# Altium schematic sheet PWB.SchDoc: =DocumentName
size A3; Scale: 1:1; DocumentType: Схема электрическая принципиальная; FirstReferrence: АБВГ.123456.001; CompanyName: "AS Manufacturing" LLC; Organization: "AS Manufacturing" LLC; Address1: 5 Sklyarenka St.; Address2: Kyiv 04073; Address3: Ukraine; Address4: https://ajax.systems/en/; SheetNumber: 1; SheetTotal: 10; Template_version: 1.0.1
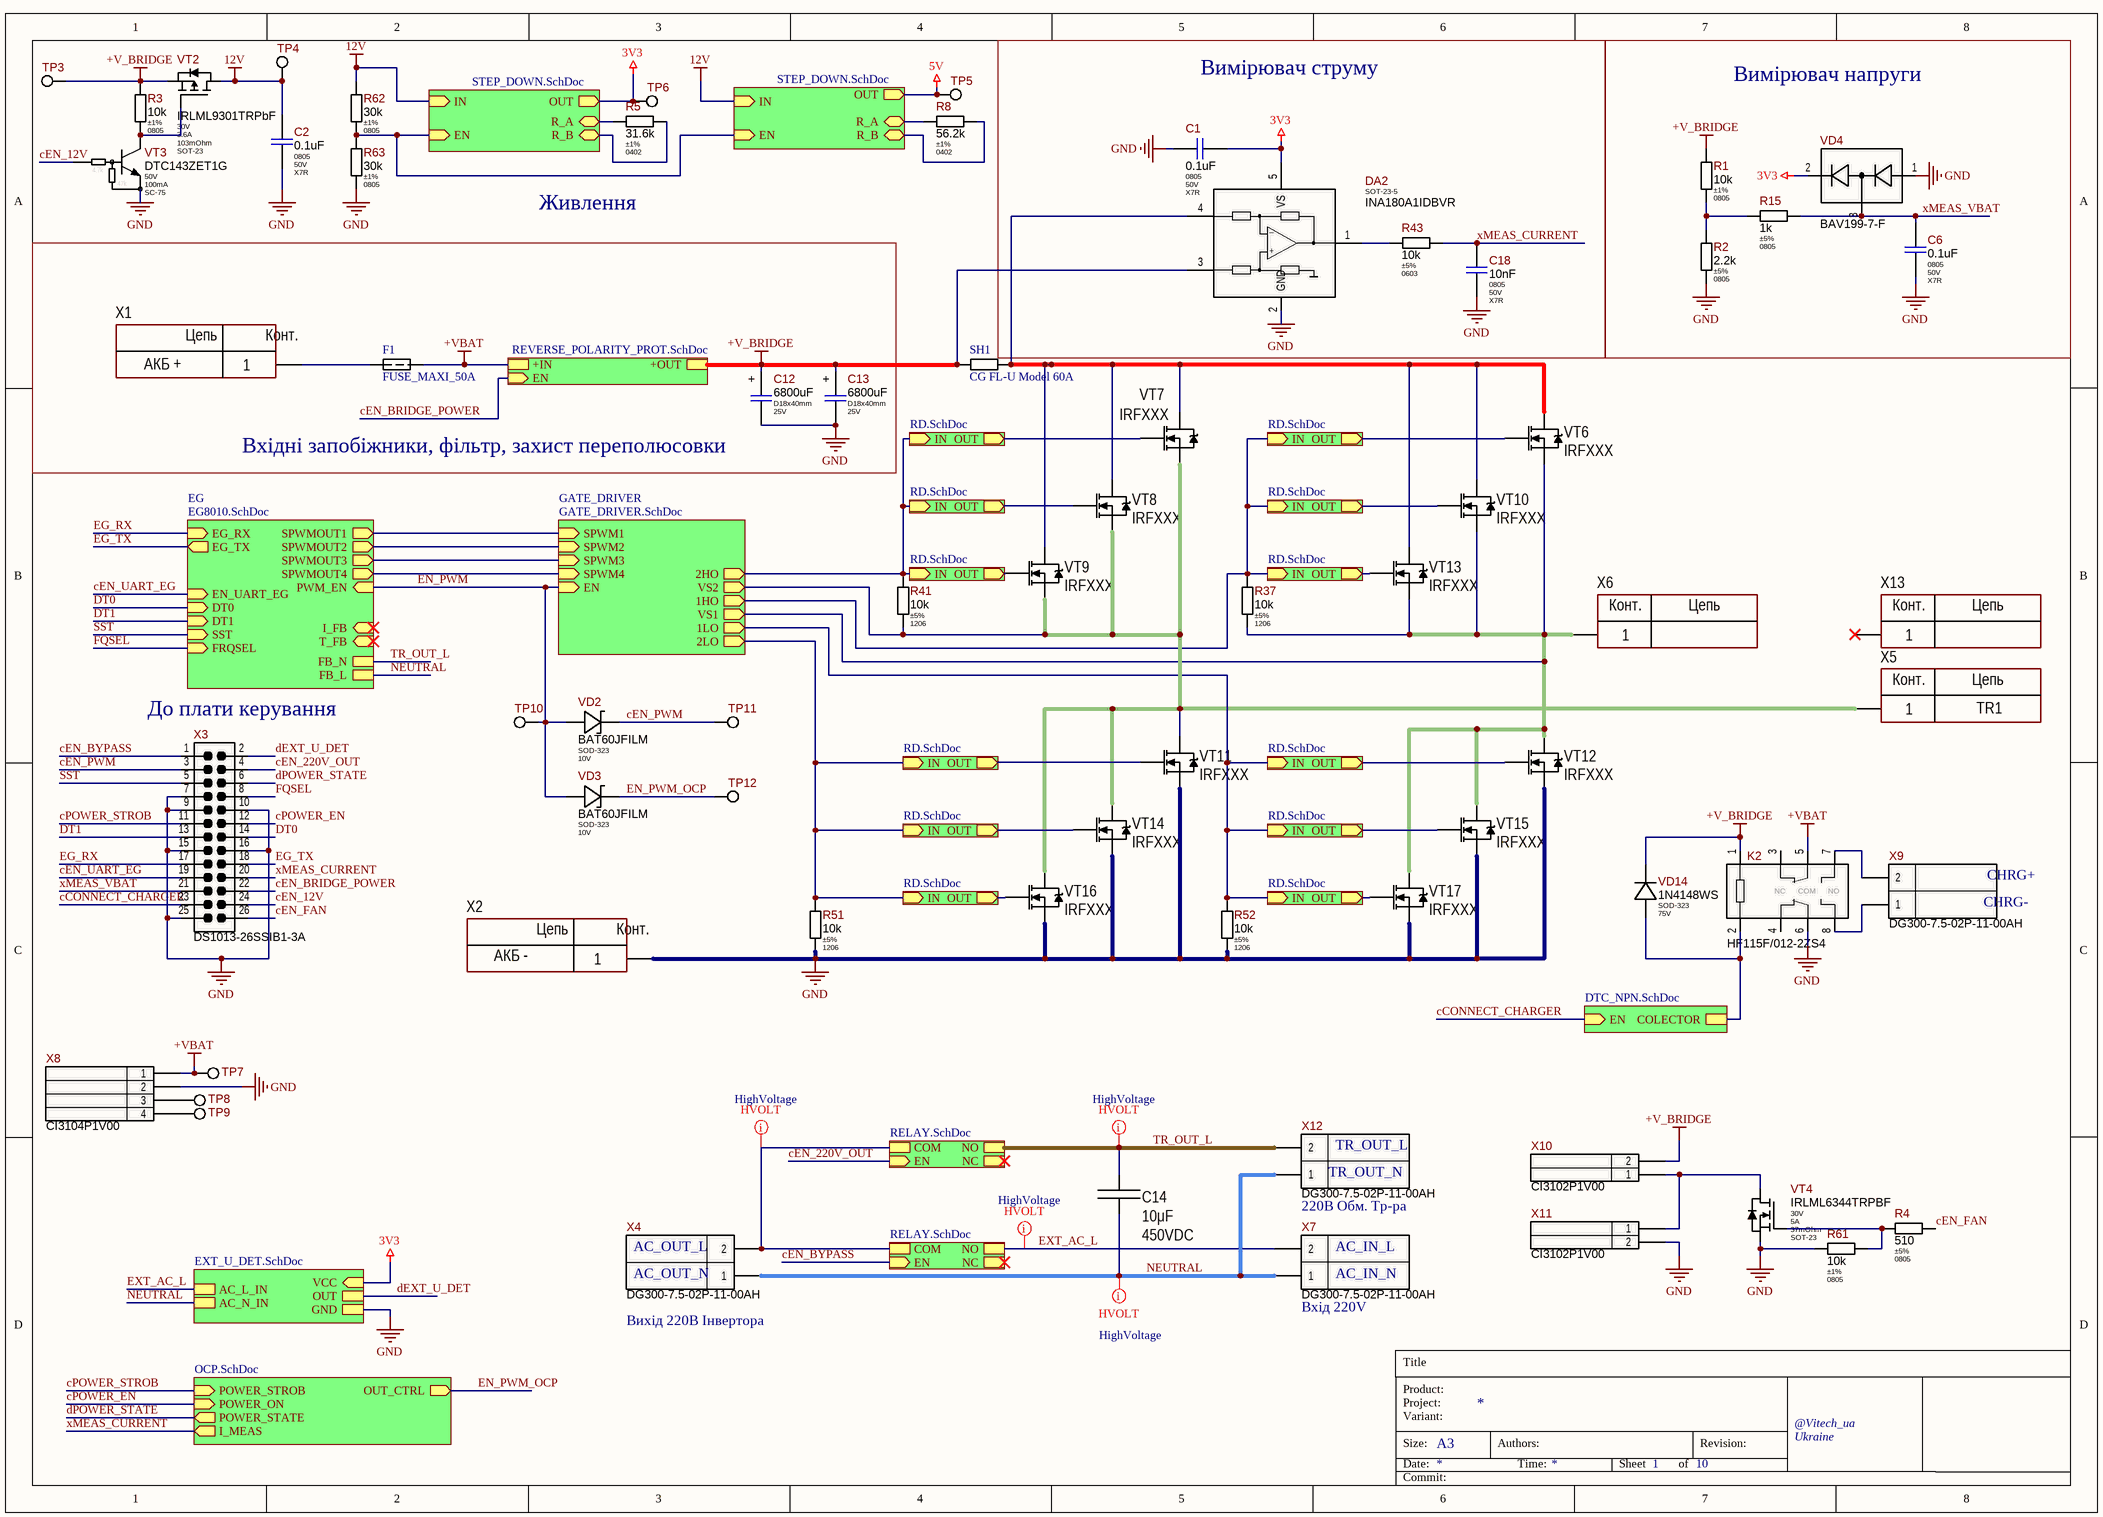
[diagram p0: PWB.SchDoc]

## Parts
C1  Package: 0805  Voltage: 50V  Dielectric Type: X7R  [CAP-0805(2012)X85T10]  (hidden comment: 0.1uF)
C2  Package: 0805  Voltage: 50V  Dielectric Type: X7R  [CAP-0805(2012)X85T10]  (hidden comment: 0.1uF)
C6  Package: 0805  Voltage: 50V  Dielectric Type: X7R  [CAP-0805(2012)X85T10]  (hidden comment: 0.1uF)
C12  value 6800uF  Package: D18x40mm  Voltage: 25V  [CAP-AE-PTH-180D05x400H20]  (hidden comment: 6800uFx25V)
C13  value 6800uF  Package: D18x40mm  Voltage: 25V  [CAP-AE-PTH-180D05x400H20]  (hidden comment: 6800uFx25V)
C14  value 10μF  Voltage: 450VDC  [CAP: B32922 (18x7x12.5mm)]
C18  Package: 0805  Voltage: 50V  Dielectric Type: X7R  [CAP-0805(2012)X65T10]  (hidden comment: 10nF)
DA2  INA180A1IDBVR  [SOT-23-5]
F1  FUSE_MAXI_50A  [FUSE_MAXI_50A]
K2  HF115F/012-2ZS4  [HF115Fxxx-1(2)Zx3(4)]
R1  Tolerance: ±1%  Package: 0805  [R_ANY_CHIP_0805_MED]  (hidden comment: 10k)
R2  Tolerance: ±5%  Package: 0805  [R_ANY_CHIP_0805_MED]  (hidden comment: 2.2k)
R3  Tolerance: ±1%  Package: 0805  [R_ANY_CHIP_0805_MED]  (hidden comment: 10k)
R4  Tolerance: ±5%  Package: 0805  [R_ANY_CHIP_0805_MED]  (hidden comment: 510)
R5  Tolerance: ±1%  Package: 0402  [R_ANY_CHIP_0402_MED]  (hidden comment: 31.6k)
R8  Tolerance: ±1%  Package: 0402  [R_ANY_CHIP_0402_MED]  (hidden comment: 56.2k)
R15  Tolerance: ±5%  Package: 0805  [R_ANY_CHIP_0805_MED]  (hidden comment: 1k)
R37  Tolerance: ±5%  Package: 1206  [R_ANY_CHIP_1206_MED]  (hidden comment: 10k)
R41  Tolerance: ±5%  Package: 1206  [R_ANY_CHIP_1206_MED]  (hidden comment: 10k)
R43  Tolerance: ±5%  Package: 0603  [R_ANY_CHIP_0603_MED]  (hidden comment: 10k)
R51  Tolerance: ±5%  Package: 1206  [R_ANY_CHIP_1206_MED]  (hidden comment: 10k)
R52  Tolerance: ±5%  Package: 1206  [R_ANY_CHIP_1206_MED]  (hidden comment: 10k)
R61  Tolerance: ±1%  Package: 0805  [R_ANY_CHIP_0805_MED]  (hidden comment: 10k)
R62  Tolerance: ±1%  Package: 0805  [R_ANY_CHIP_0805_MED]  (hidden comment: 30k)
R63  Tolerance: ±1%  Package: 0805  [R_ANY_CHIP_0805_MED]  (hidden comment: 30k)
SH1  CG FL-U Model 60A  [CG FL-U Model 60A]
TP3  PAD-0.96mm  [PAD-0.96mm]  (value not drawn)  (no BOM)
TP4  PAD-0.96mm  [PAD-0.96mm]  (value not drawn)  (no BOM)
TP5  PAD-0.96mm  [PAD-0.96mm]  (value not drawn)  (no BOM)
TP6  PAD-0.96mm  [PAD-0.96mm]  (value not drawn)  (no BOM)
TP7  PAD-0.96mm  [PAD-0.96mm]  (value not drawn)  (no BOM)
TP8  PAD-0.96mm  [PAD-0.96mm]  (value not drawn)  (no BOM)
TP9  PAD-0.96mm  [PAD-0.96mm]  (value not drawn)  (no BOM)
TP10  PAD-0.96mm  [PAD-0.96mm]  (value not drawn)  (no BOM)
TP11  PAD-0.96mm  [PAD-0.96mm]  (value not drawn)  (no BOM)
TP12  PAD-0.96mm  [PAD-0.96mm]  (value not drawn)  (no BOM)
VD2  Package: SOD-323  Voltage: 10V  [SOD-323_MED]  (hidden comment: BAT60JFILM)
VD3  Package: SOD-323  Voltage: 10V  [SOD-323_MED]  (hidden comment: BAT60JFILM)
VD4  BAV199-7-F  [SOT-23_MED]
VD14  Package: SOD-323  Voltage: 75V  [SOD-323_MED]  (hidden comment: 1N4148WS)
VT2  Vds: 30V  Id: 3.6A  Rds: 103mOhm  Package: SOT-23  [SOT-23_MED]  (hidden comment: IRLML9301TRPbF)
VT3  Vce: 50V  Ic: 100mA  Package: SC-75  [SOT-416]  (hidden comment: DTC143ZET1G)
VT4  Vds: 30V  Id: 5A  Rds: 37mOhm  Package: SOT-23  [SOT-23_MED]  (hidden comment: IRLML6344)
VT6  PartNumber: IRFXXX  [TO220(H)]
VT7  PartNumber: IRFXXX  [TO220(H)]
VT8  PartNumber: IRFXXX  [TO220(H)]
VT9  PartNumber: IRFXXX  [TO220(H)]
VT10  PartNumber: IRFXXX  [TO220(H)]
VT11  PartNumber: IRFXXX  [TO220(H)]
VT12  PartNumber: IRFXXX  [TO220(H)]
VT13  PartNumber: IRFXXX  [TO220(H)]
VT14  PartNumber: IRFXXX  [TO220(H)]
VT15  PartNumber: IRFXXX  [TO220(H)]
VT16  PartNumber: IRFXXX  [TO220(H)]
VT17  PartNumber: IRFXXX  [TO220(H)]
X1  CommentText: АКБ +  [CON: 8191]
X2  CommentText: АКБ -  [CON: 8191]
X3  DS1013-26SSIB1-3A  [BH-26]
X4  DG300-7.5-02P  [DG300-7.5-02P-11-00AH_REC]  (value not drawn)
X5  CommentText: TR1  [CON: 8191]
X6  (no value)  [CON: 8191]
X7  DG300-7.5-02P  [DG300-7.5-02P-11-00AH_REC]  (value not drawn)
X8  WH-04S  [WF-4S]  (value not drawn)
X9  DG300-7.5-02P  [DG300-7.5-02P-11-00AH_REC]  (value not drawn)
X10  WH-02S  [WF-2S]  (value not drawn)
X11  WH-02S  [WF-2S]  (value not drawn)
X12  DG300-7.5-02P  [DG300-7.5-02P-11-00AH_REC]  (value not drawn)
X13  (no value)  [CON: 8191]

## Blocks framed on the sheet
Вимірювач струму: C1 C18 DA2 R43
Вимірювач напруги: C6 R1 R2 R15 VD4
Вхідні запобіжники, фільтр, захист переполюсовки: C12 C13 F1 X1

## Sub-sheets
Designator = RELAY.SchDoc: NO, COM, NC, EN (in)
Designator = RELAY.SchDoc: NO, COM, NC, EN (in)
Designator = RD.SchDoc: IN (in), OUT (out)
Designator = RD.SchDoc: IN (in), OUT (out)
Designator = RD.SchDoc: IN (in), OUT (out)
Designator = RD.SchDoc: IN (in), OUT (out)
Designator = RD.SchDoc: IN (in), OUT (out)
Designator = RD.SchDoc: IN (in), OUT (out)
Designator = RD.SchDoc: IN (in), OUT (out)
Designator = RD.SchDoc: IN (in), OUT (out)
Designator = RD.SchDoc: IN (in), OUT (out)
Designator = RD.SchDoc: IN (in), OUT (out)
Designator = RD.SchDoc: IN (in), OUT (out)
Designator = RD.SchDoc: IN (in), OUT (out)
EG = EG8010.SchDoc: T_FB (in), I_FB (in), PWM_EN (in), SPWMOUT1 (out), SPWMOUT2 (out), SPWMOUT3 (out), SPWMOUT4 (out), EG_RX (in), EG_TX (out), DT0 (in), DT1 (in), SST (in), FRQSEL (in), FB_N, FB_L, EN_UART_EG (in)
GATE_DRIVER = GATE_DRIVER.SchDoc: SPWM3 (in), SPWM4 (in), SPWM1 (in), SPWM2 (in), EN (in), 2HO (out), 2LO (out), 1HO (out), 1LO (out), VS2 (out), VS1 (out)
OC = DTC_NPN.SchDoc: EN (in), COLECTOR
OCP = OCP.SchDoc: POWER_STROB (in), POWER_ON (in), POWER_STATE (out), OUT_CTRL (out), I_MEAS (out)
REVERSE_POL_PROT = REVERSE_POLARITY_PROT.SchDoc: +IN, +OUT, EN (in)
STEP_DOWN = STEP_DOWN.SchDoc: IN (in), OUT (out), R_A (bidir), R_B (bidir), EN (in)
STEP_DOWN = STEP_DOWN.SchDoc: IN (in), OUT (out), R_A (bidir), R_B (bidir), EN (in)
U_DET = EXT_U_DET.SchDoc: AC_L_IN, AC_N_IN, VCC (in), OUT, GND

## Nets
3V3: C1.2 DA2.5(VS) TP6.1 VD4.2 ; sheet STEP_DOWN/OUT, sheet U_DET/VCC
5V: TP5.1 ; sheet STEP_DOWN/OUT
12V: C2.1 R62.1 TP4.1 VT2.3(D) ; sheet STEP_DOWN/IN, sheet STEP_DOWN/IN
+V_BRIDGE: C12.1 C13.1 DA2.3(IN+) K2.1(COIL1) R1.2 R3.1 SH1.1 TP3.1 VD14.CA VT2.2(S) X10.2 ; sheet REVERSE_POL_PROT/+OUT
+VBAT: F1.2 K2.5(1-COM) TP7.1 X8.1 ; sheet REVERSE_POL_PROT/+IN
GND: C1.1 C2.2 C6.2 C12.2 C13.2 C18.2 DA2.2(GND) K2.6(2-COM) R2.2 R51.1 R52.1 R61.1 R63.2 VD4.1 VT3.2(E) VT4.2(S) VT11.3(S) VT12.3(S) VT14.3(S) VT15.3(S) VT16.3(S) VT17.3(S) X2.1 X3.7 X3.9 X3.10 X3.15 X3.16 X3.25 X8.2 X11.2 ; sheet U_DET/GND
cCONNECT_CHARGER: X3.23 ; sheet OC/EN
cEN_12V: VT3.1(B) X3.24
cEN_220V_OUT: X3.4 ; sheet Designator/EN
cEN_BRIDGE_POWER: X3.22 ; sheet REVERSE_POL_PROT/EN
cEN_BYPASS: X3.1 ; sheet Designator/EN
cEN_FAN: R4.2 X3.26
cEN_UART_EG: X3.19 ; sheet EG/EN_UART_EG
cPOWER_EN: X3.12 ; sheet OCP/POWER_ON
cPOWER_STROB: X3.11 ; sheet OCP/POWER_STROB
dEXT_U_DET: X3.2 ; sheet U_DET/OUT
dPOWER_STATE: X3.6 ; sheet OCP/POWER_STATE
DT0: X3.14 ; sheet EG/DT0
DT1: X3.13 ; sheet EG/DT1
EG_RX: X3.17 ; sheet EG/EG_RX
EG_TX: X3.18 ; sheet EG/EG_TX
EN_PWM: TP10.1 VD2.AN VD3.AN ; sheet EG/PWM_EN, sheet GATE_DRIVER/EN
EN_PWM_OCP: TP12.1 VD3.CA ; sheet OCP/OUT_CTRL
EXT_AC_L: X7.2 ; sheet U_DET/AC_L_IN, sheet Designator/NO
FQSEL: X3.8 ; sheet EG/FRQSEL
NEUTRAL: C14.2 X4.1 X7.1 X12.1 ; sheet EG/FB_L, sheet U_DET/AC_N_IN
SST: X3.5 ; sheet EG/SST
TR_OUT_L: C14.1 X12.2 ; sheet EG/FB_N, sheet Designator/NO
xMEAS_CURRENT: C18.1 R43.2 X3.20 ; sheet OCP/I_MEAS
xMEAS_VBAT: C6.1 R15.2 VD4.3 X3.21
сEN_PWM: TP11.1 VD2.CA X3.3
NetDA2_1: DA2.1(OUT) R43.1
NetDA2_4: DA2.4(IN-) SH1.2 VT6.2(D) VT7.2(D) VT8.2(D) VT9.2(D) VT10.2(D) VT13.2(D)
NetF1_1: F1.1 X1.1
NetK2_2: K2.2(COIL2) VD14.AN ; sheet OC/COLECTOR
NetK2_7: K2.7(2-NO) X9.2
NetK2_8: K2.8(2-NO) X9.1
NetR1_1: R1.1 R2.1 R15.1
NetR3_2: R3.2 VT2.1(G) VT3.3(C)
NetR4_1: R4.1 R61.2 VT4.1(G)
NetR5_1: R5.1 ; sheet STEP_DOWN/R_A
NetR5_2: R5.2 ; sheet STEP_DOWN/R_B
NetR8_1: R8.1 ; sheet STEP_DOWN/R_A
NetR8_2: R8.2 ; sheet STEP_DOWN/R_B
NetR37_1: R37.1 VT6.3(S) VT10.3(S) VT12.2(D) VT13.3(S) VT15.2(D) VT17.2(D) X6.1 ; sheet GATE_DRIVER/VS1
NetR37_2: R37.2 ; sheet GATE_DRIVER/1HO, sheet Designator/IN, sheet Designator/IN, sheet Designator/IN
NetR41_1: R41.1 VT7.3(S) VT8.3(S) VT9.3(S) VT11.2(D) VT14.2(D) VT16.2(D) X5.1 ; sheet GATE_DRIVER/VS2
NetR41_2: R41.2 ; sheet GATE_DRIVER/2HO, sheet Designator/IN, sheet Designator/IN, sheet Designator/IN
NetR51_2: R51.2 ; sheet GATE_DRIVER/2LO, sheet Designator/IN, sheet Designator/IN, sheet Designator/IN
NetR52_2: R52.2 ; sheet GATE_DRIVER/1LO, sheet Designator/IN, sheet Designator/IN, sheet Designator/IN
NetR62_2: R62.2 R63.1 ; sheet STEP_DOWN/EN, sheet STEP_DOWN/EN
NetTP8_1: TP8.1 X8.3
NetTP9_1: TP9.1 X8.4
NetVT4_3: VT4.3(D) X10.1 X11.1
NetVT6_1: VT6.1(G) ; sheet Designator/OUT
NetVT7_1: VT7.1(G) ; sheet Designator/OUT
NetVT8_1: VT8.1(G) ; sheet Designator/OUT
NetVT9_1: VT9.1(G) ; sheet Designator/OUT
NetVT10_1: VT10.1(G) ; sheet Designator/OUT
NetVT11_1: VT11.1(G) ; sheet Designator/OUT
NetVT12_1: VT12.1(G) ; sheet Designator/OUT
NetVT13_1: VT13.1(G) ; sheet Designator/OUT
NetVT14_1: VT14.1(G) ; sheet Designator/OUT
NetVT15_1: VT15.1(G) ; sheet Designator/OUT
NetVT16_1: VT16.1(G) ; sheet Designator/OUT
NetVT17_1: VT17.1(G) ; sheet Designator/OUT
NetX4_2: X4.2 ; sheet Designator/COM, sheet Designator/COM
(unnamed): sheet EG/SPWMOUT1, sheet GATE_DRIVER/SPWM1
(unnamed): sheet EG/SPWMOUT2, sheet GATE_DRIVER/SPWM2
(unnamed): sheet EG/SPWMOUT3, sheet GATE_DRIVER/SPWM3
(unnamed): sheet EG/SPWMOUT4, sheet GATE_DRIVER/SPWM4

Not connected (* = marked no-connect by the designer): K2 3(1-NC) 4(2-NC); X13 1*

## Layout directives
net class HighVoltage: EXT_AC_L, NetX4_2, NEUTRAL, TR_OUT_L

## Notes on the sheet
- Живлення
- (near X3) До плати керування
- CHRG-
- CHRG+
- (near X12) TR_OUT_N
- (near X12) TR_OUT_L
- (near X4) AC_OUT_L
- 220В Обм. Тр-ра
- (near X7) AC_IN_L
- (near X4) Вихід 220В Інвертора
- (near X4) AC_OUT_N
- (near X7) Вхід 220V
- (near X7) AC_IN_N
- Title
- Product:
- Project:
- Size:
- Date:
- Variant:
- A3
- Authors:
- Time:
- Sheet
- of
- Revision:
- @Vitech_ua
- Commit:
- (in symbol B41858C5688M000) +
- (in symbol Connector_single_power) Цепь; Конт.
- (in symbol DTC143ZET1G) 4.7k; 47k
- (in symbol HF115F/012-2ZS4) NC; COM; NO
- (in symbol INA180A1IDBVR) _; +

## Library data of the parts
C1 C2 C6 = CL21B104KBCNNNC: 100nF 50V X7R ±10% 0805 Ceramic Capacitor RoHS; Manufacturer: Samsung Electro-Mechanics; Ajax_1C_ID: 1251; Ajax_1C_PN: 100nF 50V X7R 10% 0805 CL21B104KBCNNNC Ceramic Capacitor SMD RoHS; Ajax_1С_Status: Mass Production; Standard Lead Time: 22 Weeks; Component Status: Released; Replacement: NONE; GUID_1C: 2c368b99-dd41-11e0-af93-6c626deda1bb; Value: 0.1uF; Part Number: CL21B104KBCNNNC; Part Type: Ceramic / X7R / 0805; Component Type: SMD; Temperature Range: -55°C ~ 125°C; Tolerance: ±10%; ComponentLink1URL: https://media.digikey.com/pdf/Data%20Sheets/Samsung%20PDFs/CL_Series_MLCC_ds.pdf; Supplier 1: Digi-Key; Supplier Part Number 1: 1276-1003-2-ND; Price: 0,00700031; ComponentLink1Description: Datasheet
C12 C13 = B41858C5688M000: 6800uF 25V ±20% Aluminum Electrolytic Capacitors Radial, 5000 Hrs @ 105°C, 4467mA Ripple Current; Manufacturer: Epcos / TDK; Ajax_1C_PN: NONE; Ajax_1С_Status: RND Only; Standard Lead Time: 36 Weeks; Component Status: Released; Part Number: B41858C5688M000; Part Type: Aluminum; Component Type: PTH; Temperature Range: -55°C ~ 105°C; Tolerance: ±20%; Dielectric Type: NONE; ComponentLink1URL: https://product.tdk.com/system/files/dam/doc/product/capacitor/aluminum-electrolytic/single-ended/data_sheet/20/30/db/aec/b41858.pdf; Supplier 1: Mouser; Supplier Part Number 1: 871-B41858C5688M; Replacement: NONE; Price: NONE; ComponentLink1Description: Datasheet
C14 = Film: Manufacturer: Epcos; PartNumber: B32774D4106K000; ValueManufacturerPartNumber: Film capacitor, 10μF, 450VDC, ±10%, 10.9mOhm, 31.5x15 mm, -40...+105°C; TypeCapacitor: Film capacitor; Tolerance: ±10%; Impedance: 10.9mOhm; Package: 31.5x15 mm; HelpURL: https://www.digikey.com/products/en/capacitors/film-capacitors/62?k=&pkeyword=&sv=0&pv2097=1958&sf=0&FV=fffc01ef%2C1f140000%2Cffe0003e%2Cffec6366&quantity=1&ColumnSort=1000011&page=1&stock=1&pageSize=25; Temperature: -40...+105°C
C18 = CL21B103KBANNNC: 10nF 50V X7R ±10% 0805 Ceramic Capacitor RoHS; Manufacturer: Samsung Electro-Mechanics; Ajax_1C_PN: NONE; Ajax_1С_Status: RND Only; Standard Lead Time: 26 Weeks; Component Status: Released; Value: 10nF; Part Number: CL21B103KBANNNC; Part Type: Ceramic / X7R / 0805; Component Type: SMD; Temperature Range: -55°C ~ 125°C; Tolerance: ±10%; ComponentLink1URL: https://eu.mouser.com/datasheet/2/585/MLCC-1837944.pdf; Supplier 1: Mouser; Supplier Part Number 1: 187-CL21B103KBANNNC; Replacement: NONE; Price: NONE; ComponentLink1Description: Datasheet
DA2 = INA180A1IDBVR: Low- and High-Side Voltage Output, 2.7V to 5.5V, Current-Sense Amplifiers, Gain 20 V/V, SOT-23-5; Manufacturer: Texas Instruments; Ajax_1C_ID: 25363; Ajax_1C_PN: INA180A1IDBVT TI Current Sense Amplifier, SOT-23-5; Ajax_1С_Status: RND Only; Standard Lead Time: 12 Weeks; Component Status: Released; Replacement: NONE; GUID_1C: 575c0dc1-4f39-11eb-ab6e-0050569f2651; Package: SOT-23-5; Part Number: INA180A1IDBVR; Part Type: Amplifier / Current Sense; Component Type: SMD; Temperature Range: -40°C ~ 125°C; ComponentLink1URL: https://www.ti.com/lit/ds/symlink/ina180.pdf; Supplier 1: Digi-Key; Supplier Part Number 1: 296-47652-2-ND; Price: 0,367; ComponentLink1Description: Datasheet
F1 = FUSE_MAXI_50A: Fuse; Manufacturer_Name: LITTELFUSE; Manufacturer_Part_Number: 17861640001; Datasheet Link: https://www.littelfuse.com/media?resourcetype=2d-prints&itemid=dcb90cf3-0771-4ccd-8726-26101cf00574&filename=ol-178.6164.0000(c); Height: 17.5mm
K2 = HF115F/012-2ZS4: Miniature High Power Relay, DPDT (2 Form C), 12VDC 400mW Coil, 5.0mm 2 Pole 8A AgCdO; Manufacturer: Hongfa; Ajax_1C_ID: 38428; Ajax_1C_PN: HF115F/012-2ZS4 HONGFA, Реле; Ajax_1С_Status: RND Only; Component Status: Released; Replacement: NONE; GUID_1C: 4ba44618-64be-11ec-a90c-00505699469b; Part Number: HF115F/012-2ZS4; Part Type: Relay; Component Type: PTH; Temperature Range: -40°C ~ 85°C; ComponentLink1URL: https://www.tme.eu/Document/2962d862af219292e2e76bbc4b5ef3a2/hf115f.pdf; Supplier 1: TME; Supplier Part Number 1: HF115F/012-2ZS4; Price: 2,02140634; ComponentLink1Description: Datasheet
R1 R3 R61 = RC0805FR-0710K2L: 10 kOhms ±1%, 1/8W 0805 Thick Film Resistor; Manufacturer: Yageo; Ajax_1C_ID: 13943; Ajax_1C_PN: 10.2k 1% 0805 Resistors SMD RoHS; Ajax_1С_Status: Mass Production; Power Rating: 0.125W; Voltage: 150V; Component Status: Released; Temperature Stability: ±100ppm/°C; Replacement: NONE; GUID_1C: 8bc9d0ce-c58a-11e8-ab47-0050569f2651; Value: 10k; Part Number: RC0805FR-0710K2L; Component Type: SMD; Part Type: Thick Film; Temperature Range: -55°C ~ 155°C; ComponentLink1URL: https://eu.mouser.com/datasheet/2/447/PYu_RC_Group_51_RoHS_L_10-1664068.pdf; Supplier 1: Digi-Key; Supplier Part Number 1: 311-10.2KCRTR-ND; Price: 0,0014; ComponentLink1Description: Datasheet
R2 = RC0805JR-072K2L: 2.2 kOhms ±5% 1/8W 0805 Thick Film Resistor; Manufacturer: Yageo; Ajax_1C_ID: 26119; Ajax_1C_PN: 2.2k 5% 0805 Resistors SMD RoHS; Ajax_1С_Status: RND Only; Power Rating: 0.125W; Voltage: 150V; Component Status: Released; Temperature Stability: ±100ppm/°C; Replacement: NONE; GUID_1C: 80325ec8-617a-11eb-ab6f-0050569f2651; Value: 2.2k; Part Number: RC0805JR-072K2L; Component Type: SMD; Part Type: Thick Film; Temperature Range: -55°C ~ 155°C; ComponentLink1URL: https://eu.mouser.com/datasheet/2/447/PYu_RC_Group_51_RoHS_L_11-1984063.pdf; Supplier 1: Digi-Key; Supplier Part Number 1: 311-2.2KARTR-ND; Price: 0,005; ComponentLink1Description: Datasheet
R4 = CRCW0805510RJNEA: 510 Ohms ±5%, 1/8W 0805 Thick Film Resistor; Manufacturer: Vishay; Ajax_1C_ID: 9454; Ajax_1C_PN: 510R 5% 0805 Resistors SMD RoHS; Ajax_1С_Status: RND Only; Power Rating: 0.125W; Voltage: 150V; Component Status: Released; Temperature Stability: ±200ppm/°C; Replacement: NONE; GUID_1C: 51b8dd24-e3a6-11e6-82a2-d8cb8a9acc66; Value: 510; Part Number: CRCW0805510RJNEA; Component Type: SMD; Part Type: Thick Film; Temperature Range: -55°C ~ 155°C; ComponentLink1URL: https://eu.mouser.com/datasheet/2/427/dcrcwe3-1762152.pdf; Supplier 1: Mouser; Supplier Part Number 1: 71-CRCW0805510RJNEA; Price: 0,09; ComponentLink1Description: Datasheet
R5 = RC0402FR-0731K6L: 31.6 kOhms ±1% 1/16W 0402 Thick Film Resistor; Manufacturer: Yageo; Ajax_1C_ID: 42440; Ajax_1C_PN: 31.6k 1% 0402 Resistors SMD RoHS; Ajax_1С_Status: RND Only; Power Rating: 0.062W; Voltage: 50V; Component Status: Released; Temperature Stability: ±100ppm/°C; Replacement: NONE; GUID_1C: e9ef95d9-cab3-11ec-a360-005056994834; Value: 31.6k; Part Number: RC0402FR-0731K6L; Component Type: SMD; Part Type: Thick Film; Temperature Range: -55°C ~ 155°C; ComponentLink1URL: https://eu.mouser.com/datasheet/2/447/PYu_RC_Group_51_RoHS_L_11-1984063.pdf; Supplier 1: Mouser; Supplier Part Number 1: 603-RC0402FR-0731K6L; Price: 0,013; ComponentLink1Description: Datasheet
R8 = RC0402FR-0756K2L: 56.2 kOhms ±1% 1/16W 0402 Thick Film Resistor; Manufacturer: Yageo; Ajax_1C_ID: 20241; Ajax_1C_PN: 56.2k 1% 0402 Resistors SMD RoHS; Ajax_1С_Status: Mass Production; Power Rating: 0.062W; Voltage: 50V; Component Status: Released; Temperature Stability: ±100ppm/°C; Replacement: NONE; GUID_1C: 73881b35-8945-11ea-ab60-0050569f2651; Value: 56.2k; Part Number: RC0402FR-0756K2L; Component Type: SMD; Part Type: Thick Film; Temperature Range: -55°C ~ 155°C; ComponentLink1URL: https://eu.mouser.com/datasheet/2/447/PYu_RC_Group_51_RoHS_L_11-1984063.pdf; Supplier 1: Digi-Key; Supplier Part Number 1: YAG3187TR-ND; Price: 0,00065; ComponentLink1Description: Datasheet
R15 = RC0805JR-071KL: 1 kOhms ±5%, 1/8W 0805 Thick Film Resistor; Manufacturer: Yageo; Ajax_1C_PN: NONE; Ajax_1С_Status: RND Only; Power Rating: 0.125W; Voltage: 150V; Component Status: Released; Temperature Stability: ±100ppm/°C; Value: 1k; Part Number: RC0805JR-071KL; Component Type: SMD; Part Type: Thick Film; Temperature Range: -55°C ~ 155°C; ComponentLink1URL: https://eu.mouser.com/datasheet/2/447/PYu_RC_Group_51_RoHS_L_11-1984063.pdf; Supplier 1: Digi-Key; Supplier Part Number 1: 311-1.0KARTR-ND; Replacement: NONE; Price: NONE; ComponentLink1Description: Datasheet
R37 R41 R51 R52 = RC1206JR-0710KL: 10 kOhms ±5% 1/4W 1206 Thick Film Resistor; Manufacturer: Yageo; Ajax_1C_ID: 29423; Ajax_1C_PN: 10k 5% 1206 Resistors SMD RoHS; Ajax_1С_Status: RND Only; Power Rating: 0.25W; Voltage: 200V; Component Status: Released; Temperature Stability: ±100ppm/°C; Replacement: NONE; GUID_1C: e3e7c694-a8f0-11eb-ab74-0050569f2651; Value: 10k; Part Number: RC1206JR-0710KL; Component Type: SMD; Part Type: Thick Film; Temperature Range: -55°C ~ 155°C; ComponentLink1URL: https://eu.mouser.com/datasheet/2/447/PYu_RC_Group_51_RoHS_L_11-1984063.pdf; Supplier 1: Digi-Key; Supplier Part Number 1: 311-10KERTR-ND; Price: 0,0018; ComponentLink1Description: Datasheet
R43 = RC0603JR-0710KL: 10 kOhms ±5%, 1/10W 0603 Thick Film Resistor; Manufacturer: Yageo; Ajax_1C_ID: 2860; Ajax_1C_PN: 10k 5% 0603 Resistors SMD RoHS; Ajax_1С_Status: Mass Production; Power Rating: 0.1W; Voltage: 75V; Component Status: Released; Temperature Stability: ±100ppm/°C; Replacement: NONE; GUID_1C: df4c2852-e567-11e2-9779-6c626deda1bb; Value: 10k; Part Number: RC0603JR-0710KL; Component Type: SMD; Part Type: Thick Film; Temperature Range: -55°C ~ 155°C; ComponentLink1URL: https://eu.mouser.com/datasheet/2/447/PYu_RC_Group_51_RoHS_L_10-1664068.pdf; Supplier 1: Digi-Key; Supplier Part Number 1: 311-10KGRTR-ND; Price: 0,0006; ComponentLink1Description: Datasheet
R62 R63 = RC0805FR-0730KL: 30 kOhms ±1%, 1/8W 0805 Thick Film Resistor; Manufacturer: Yageo; Ajax_1C_ID: 9642; Ajax_1C_PN: 30k 1% 0805 Resistors SMD RoHS; Ajax_1С_Status: Mass Production; Power Rating: 0.125W; Voltage: 150V; Component Status: Released; Temperature Stability: ±100ppm/°C; Replacement: NONE; GUID_1C: 71e2aa09-07e0-11e7-82d0-d8cb8a9acc66; Value: 30k; Part Number: RC0805FR-0730KL; Component Type: SMD; Part Type: Thick Film; Temperature Range: -55°C ~ 155°C; ComponentLink1URL: https://eu.mouser.com/datasheet/2/447/PYu_RC_Group_51_RoHS_L_10-1664068.pdf; Supplier 1: Digi-Key; Supplier Part Number 1: 311-30.0KCRTR-ND; Price: 0,001; ComponentLink1Description: Datasheet
TP3-TP12 = PAD-0.96mm: 0.96mm Pad for Plug-In or Receptacle; Ajax_1C_PN: NONE; Ajax_1С_Status: RND Only; Component Status: Released; Part Number: PAD-0.96mm; Component Type: PTH; Manufacturer: NONE; Part Type: Pad; Temperature Range: NONE; ComponentLink1URL: NONE; Replacement: NONE; Price: NONE; ComponentLink1Description: Datasheet
VD2 VD3 = BAT60JFILM: Diode Schottky 10V 3A, SOD-323; Manufacturer: STMicroelectronics; Ajax_1C_ID: 4777; Ajax_1C_PN: BAT60JFILM SOD-323 ST Диод; Ajax_1С_Status: Mass Production; Marking: 60; Component Status: Released; Standard Lead Time: 17 Weeks; Vf: 580mV @ 1A; Replacement: NONE; GUID_1C: a9f1f773-fd28-11e3-b679-a45d36c4a9e5; Part Number: BAT60JFILM; Part Type: Schottky; Component Type: SMD; Current: 3A; Temperature Range: -65°C ~ 150°C; ComponentLink1URL: http://www.st.com/content/ccc/resource/technical/document/datasheet/3d/d2/27/1d/20/e3/4d/48/CD00001944.pdf/files/CD00001944.pdf/jcr:content/translations/en.CD00001944.pdf; Supplier 1: Digi-Key; Supplier Part Number 1: 497-3707-2-ND; Price: 0; ComponentLink1Description: Datasheet
VD4 = BAV199-7-F: Diode Array 1 Pair Series Connection Standard 85V 160mA, 5nA Reverse Current, SOT-23; Manufacturer: Diodes Incorporated; Ajax_1C_ID: 25391; Ajax_1C_PN: BAV199-7-F (SOT-23) диод; Ajax_1С_Status: RND Only; Marking: K52; Component Status: Released; Standard Lead Time: 30 Weeks; Vf: 1.25V @ 150 mA; Replacement: NONE; GUID_1C: 0951ac93-5400-11eb-ab6e-0050569f2651; Voltage: 85V; Part Number: BAV199-7-F; Part Type: Array; Component Type: SMD; Package: SOT-23; Current: 160mA; Temperature Range: -65°C ~ 150°C; ComponentLink1URL: https://eu.mouser.com/datasheet/2/115/DIOD_S_A0008363444_1-2543096.pdf; Supplier 1: Mouser; Supplier Part Number 1: 621-BAV199-F; Price: 0,022; ComponentLink1Description: Datasheet
VD14 = 1N4148WS: Diode Standard 75V 150mA, SOD-323F; Manufacturer: Diodec Semiconductor; Ajax_1C_ID: 10255; Ajax_1C_PN: 1N4148WS diotec SOD-323; Ajax_1С_Status: Mass Production; Marking: W2; Component Status: Released; Standard Lead Time: NONE; Vf: 1V @ 50mA; Replacement: 1N4148WS-E; GUID_1C: 3d8ac204-519f-11e7-8106-14dda9d2d04d; Part Type: Fast Switching; Component Type: SMD; Current: 150mA; Temperature Range: -55°C ~ 150°C; ComponentLink1URL: https://diotec.com/tl_files/diotec/files/pdf/datasheets/1n4148ws.pdf; Supplier 1: TME; Supplier Part Number 1: 1N4148WS-DIO; Price: 0,00864; ComponentLink1Description: Datasheet; Part Number: 1N4148WS
VT2 = IRLML9301TRPbF: -30V, -3.6A max P-Channel HEXFET MOSFET, 82mOhm @ Vgs = -4.5V; Manufacturer: Infineon Technologies; Ajax_1C_ID: 18293; Ajax_1C_PN: IRLML9301TRPBF SOT-23-3; Ajax_1С_Status: RND Only; Component Status: Released; Standard Lead Time: 77 Weeks; Replacement: NONE; GUID_1C: 9e524eff-1dcc-11ea-ab59-0050569f2651; Part Number: IRLML9301TRPbF; Part Type: P-Channel; Component Type: SMD; Temperature Range: -55°C ~ 150°C; ComponentLink1URL: https://eu.mouser.com/datasheet/2/196/Infineon_IRLML9301_DataSheet_v01_01_EN-1732998.pdf; Supplier 1: Mouser; Supplier Part Number 1: IRLML9301TRPbF; Price: 0,12469714; ComponentLink1Description: Datasheet
VT3 = DTC143ZET1G: 50V, 100mA Low Vce(sat) NPN Digital Transistor, Pre-Biased 4.7k/47k (with built-in resistors); Manufacturer: Onsemi; Ajax_1C_ID: 9410; Ajax_1C_PN: DTC143ZET1G SC-75-3  биполярный NPN транзистор; Ajax_1С_Status: Mass Production; Component Status: Released; Standard Lead Time: 8 Weeks; Replacement: NONE; GUID_1C: d76ac5d5-de69-11e6-829b-d8cb8a9acc66; Part Number: DTC143ZET1G; Part Type: NPN; Component Type: SMD; Temperature Range: -55°C ~ 150 °C; ComponentLink1URL: http://www.onsemi.com/pub/Collateral/DTC143Z-D.PDF; Supplier 1: Digi-Key; Supplier Part Number 1: DTC143ZET1GOSTR-ND; Price: 0,0125; ComponentLink1Description: Datasheet
VT4 = IRLML6344TRPBF: 30V, 5A max N-Channel HEXFET MOSFET, 29mOhm @ Vgs = 4.5V; Manufacturer: Infineon Technologies; Ajax_1C_ID: 9416; Ajax_1C_PN: IRLML6344TRPBF  SOT23. полевой транзистор; Ajax_1С_Status: RND Only; Component Status: Released; Standard Lead Time: 16 Weeks; Replacement: NONE; GUID_1C: 8299d48f-df0c-11e6-829c-d8cb8a9acc66; Part Number: IRLML6344TRPBF; Part Type: N-Channel; Component Type: SMD; Temperature Range: -55°C ~ 150°C; ComponentLink1URL: https://www.infineon.com/dgdl/irlml6344pbf.pdf?fileId=5546d462533600a4015356689c44262c; Supplier 1: Digi-Key; Supplier Part Number 1: IRLML6344TRPBFTR-ND; Price: 0,11485255; ComponentLink1Description: Datasheet
VT6-VT17 = MOSFET_N_123: Manufacturer: Infineon Technologies; ValueManufacturerPartNumber: MOSFET N-channel transistor, 80V, 7A, 9.1nC, 2.5W, 34mOhm, 756pF, 8-TDSON, -55...+150°C; TypeTransistor: MOSFET N-channel transistor; VoltageDS: 80V; CurrentDS: 7A; RDS: 34mOhm; GateCharge: 9.1nC; InputCapacitor: 756pF; MaxPower: 2.5W; Package: 8-TDSON; HelpURL: https://www.digikey.com/product-detail/en/infineon-technologies/BSC340N08NS3GATMA1/BSC340N08NS3GATMA1TR-ND/2080655; Temperature: -55...+150°C
X1 X2 X5 X6 X13 = Connector_single_power: ValueManufacturerPartNumber: Power connector, *, *; TypeConnector: Power connector; Manufacturer: *; HelpURL: *; PartNumber: *; VoltageMax: *; CurrentMax: *
X3 = DS1013-26SSIB1-3A: 2.54mm Vertical Box Header, Two Rows, 26 Pin, 20mOhm max, Male IDC BH-26; Manufacturer: Connfly; Ajax_1C_ID: 14527; Ajax_1C_PN: BH-26 : Вилка в плату IDC : IDC-26; Ajax_1С_Status: RND Only; Component Status: Released; Replacement: NONE; GUID_1C: b61e51fd-0757-11e9-ab4d-0050569f2651; System: Connector; Part Number: DS1013-26SSIB1-3A; Part Type: IDC (Box Header) / Vertical; Component Type: PTH; Temperature Range: -40°C ~ 105°C; ComponentLink1URL: \\altiumdb.ajax.local\files\Datasheet\Connectors\DS1013.pdf; Price: 0,1; ComponentLink1Description: Datasheet
X4 X7 X9 X12 = DG300-7.5-02P-11-00AH: Screw Terminal, 7.5mm Pitch, 2 pin, Grey; Manufacturer: Degson; Ajax_1C_ID: 14664; Ajax_1С_Status: RND Only; Component Status: Released; Replacement: NONE; GUID_1C: 80a5b435-17ec-11e9-ab4d-0050569f1984; Part Number: DG300-7.5-02P-11-00AH; Ajax_1C_PN: DG300-7.5-02P-11-00AH; Part Type: Terminal; Component Type: PTH; Temperature Range: -30°C ~ 120°C; ComponentLink1URL: https://www.tme.eu/Document/adcdc895102d44b158b752608cb08ff1/DG300-5.0.pdf; Supplier 1: TME; Supplier Part Number 1: DG300-7.5-2P11; Price: 0,108; ComponentLink1Description: Datasheet
X8 = CI3104P1V00: WH Series 2.54mm Wire to Board Straight DIP Type Headers, 4 Pin; Manufacturer: CviLux; Ajax_1C_ID: 1232; Ajax_1C_PN: WF-04S, разъем 4 пина "папа", на плату; Ajax_1С_Status: RND Only; Component Status: Released; Replacement: NONE; GUID_1C: 2c368b74-dd41-11e0-af93-6c626deda1bb; Part Number: CI3104P1V00; Part Type: Wire-to-Board / Header; Component Type: PTH; Temperature Range: -25℃ ~ 85℃; ComponentLink1URL: \\altiumdb.ajax.local\files\Datasheet\Connectors\CI3102S.pdf; Price: 0,01936; ComponentLink1Description: Datasheet
X10 X11 = CI3102P1V00: WH Series 2.54mm Wire to Board Straight DIP Type Headers, 2 Pin; Manufacturer: CviLux; Ajax_1C_ID: 6817; Ajax_1C_PN: WF-02S (DS1070-2M) Штекер "папа"; 2 контакта; шаг 2.54мм; прямой; на плату; Ajax_1С_Status: RND Only; Component Status: Released; Replacement: NONE; GUID_1C: 74812bc3-35d6-11e5-ad28-a45d36c4a9e5; Part Number: CI3102P1V00; Part Type: Wire-to-Board / Header; Component Type: PTH; Temperature Range: -25℃ ~ 85℃; ComponentLink1URL: \\altiumdb.ajax.local\files\Datasheet\Connectors\CI3102S.pdf; Price: 0,016; ComponentLink1Description: Datasheet
SH1 = CG FL-U Model 60A: link: http://www.cnchog.com/products/40a-220a-ID167.html